# Altium schematic sheet Driver.SchDoc
size A4; SheetNumber: 1; SheetTotal: 1
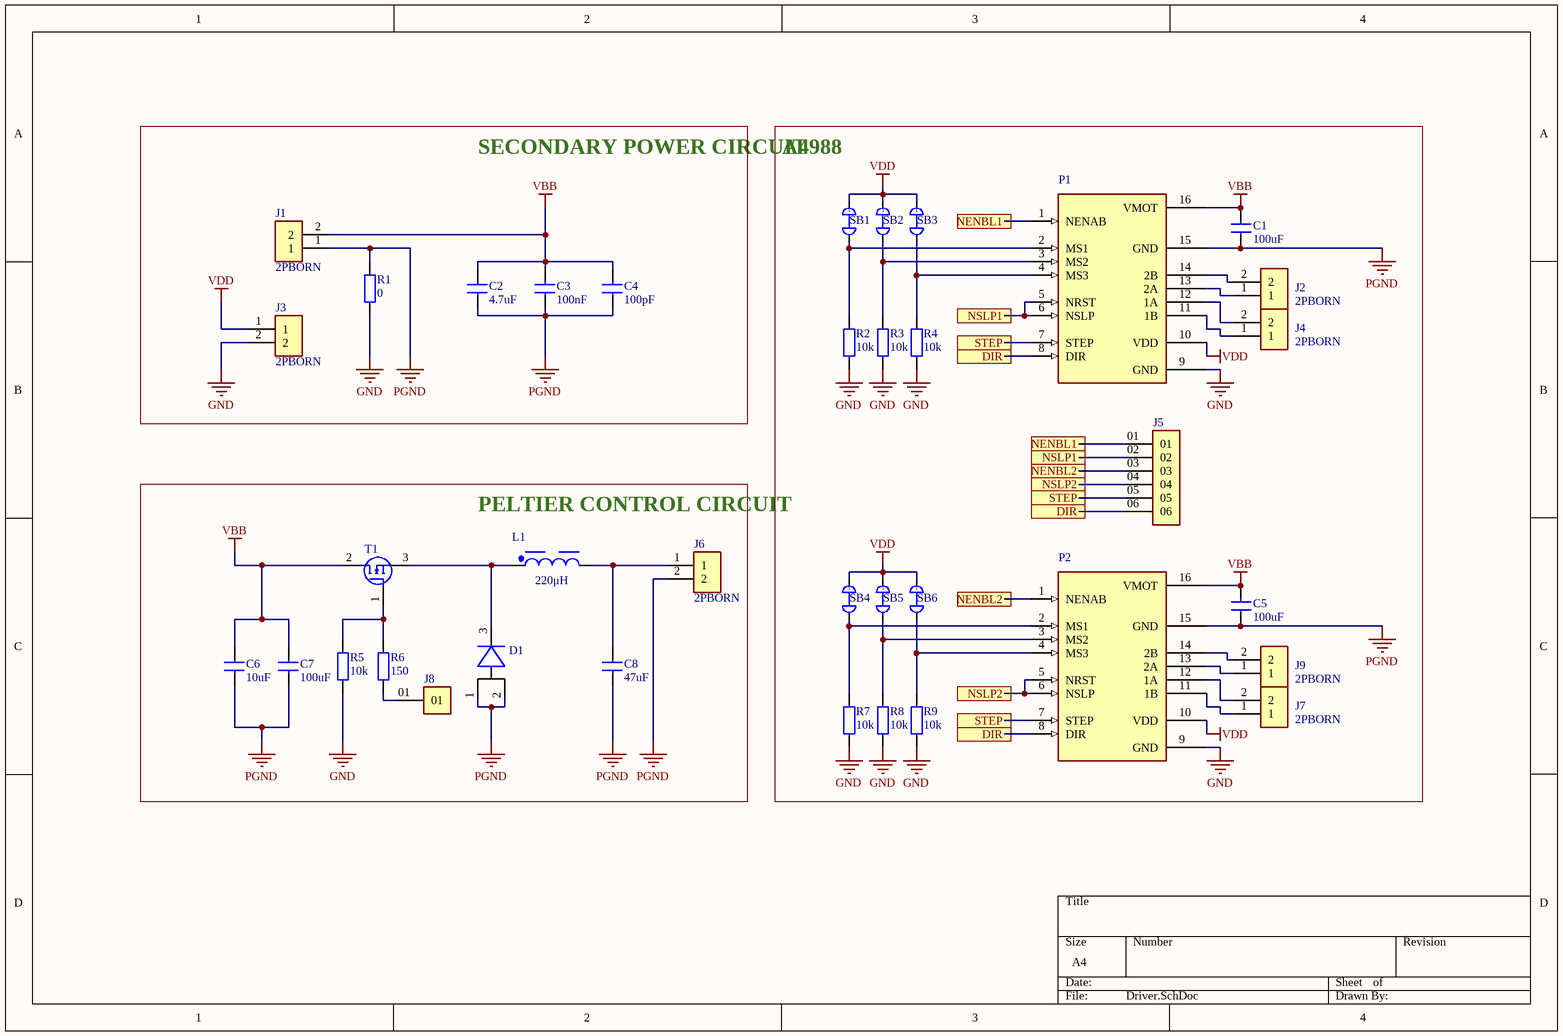
[diagram p0: Driver.SchDoc]

## Parts
C1  100uF  [RES_0805]
C2  4.7uF  [RES_0805]
C3  100nF  [RES_0805]
C4  100pF  [RES_0805]
C5  100uF  [RES_0805]
C6  10uF  [RES_0805]
C7  100uF  [RES_0805]
C8  47uF  [RES_0805]
D1  DIODE_FSV15150V  [FSV15150V_TO-277]  (value not drawn)
J1  2PBORN  [CUI_TB002-500-02BE]
J2  2PBORN  [CUI_TB002-500-02BE]
J3  2PBORN  [CUI_TB002-500-02BE]
J4  2PBORN  [CUI_TB002-500-02BE]
J5  PIN_HEADER_6  [GEN_PIN6]  (value not drawn)
J6  2PBORN  [CUI_TB002-500-02BE]
J7  2PBORN  [CUI_TB002-500-02BE]
J8  PIN_HEADER_1  [GEN_PIN1]  (value not drawn)
J9  2PBORN  [CUI_TB002-500-02BE]
L1  220μH  [WE-HCF_2920]
P1  2x8_PINES  [PINES8x2-sep]  (value not drawn)
P2  2x8_PINES  [PINES8x2-sep]  (value not drawn)
R1  0  [RES_0805]
R2  10k  [RES_0805]
R3  10k  [RES_0805]
R4  10k  [RES_0805]
R5  10k  [RES_0805]
R6  150  [RES_0805]
R7  10k  [RES_0805]
R8  10k  [RES_0805]
R9  10k  [RES_0805]
SB1  SolderBridge_Short  [SolderBridge_Short]  (value not drawn)
SB2  SolderBridge_Short  [SolderBridge_Short]  (value not drawn)
SB3  SolderBridge_Short  [SolderBridge_Short]  (value not drawn)
SB4  SolderBridge_Short  [SolderBridge_Short]  (value not drawn)
SB5  SolderBridge_Short  [SolderBridge_Short]  (value not drawn)
SB6  SolderBridge_Short  [SolderBridge_Short]  (value not drawn)
T1  NMOS-DMT10H010LK3  [MOSFET_TRANS_2DB1184Q-13]  (value not drawn)

## Blocks framed on the sheet
SECONDARY POWER CIRCUIT: C2-C4 J1 J3 R1
A4988: C1 C5 J2 J4 J5 J7 J9 P1 P2 R2-R4 R7-R9 SB1-SB6
PELTIER CONTROL CIRCUIT: C6-C8 D1 J6 J8 L1 R5 R6 T1

## Nets
GND: J3.2 P1.9(GND) P2.9(GND) R1.1 R2.1 R3.1 R4.1 R5.1 R7.1 R8.1 R9.1
PGND: C1.2 C2.1 C3.1 C4.1 C5.2 C6.1 C7.1 C8.1 D1.1(A) D1.2 J1.1 J6.2 P1.15(GND) P2.15(GND) R1.2
VBB: C1.1 C2.2 C3.2 C4.2 C5.1 C6.2 C7.2 J1.2 P1.16(VMOT) P2.16(VMOT) T1.2(D)
VDD: J3.1 P1.10(VDD) P2.10(VDD) SB1.1 SB2.1 SB3.1 SB4.1 SB5.1 SB6.1
DIR: J5.06 P1.8(DIR) P2.8(DIR)
NENBL1: J5.01 P1.1(NENAB)
NENBL2: J5.03 P2.1(NENAB)
NSLP1: J5.02 P1.5(NRST) P1.6(NSLP)
NSLP2: J5.04 P2.5(NRST) P2.6(NSLP)
STEP: J5.05 P1.7(STEP) P2.7(STEP)
NetC8_2: C8.2 J6.1 L1.2
NetD1_3: D1.3(C) L1.1 T1.3(S)
NetJ2_1: J2.1 P1.13(2A)
NetJ2_2: J2.2 P1.14(2B)
NetJ4_1: J4.1 P1.11(1B)
NetJ4_2: J4.2 P1.12(1A)
NetJ7_1: J7.1 P2.11(1B)
NetJ7_2: J7.2 P2.12(1A)
NetJ8_01: J8.01 R6.1
NetJ9_1: J9.1 P2.13(2A)
NetJ9_2: J9.2 P2.14(2B)
NetP1_2: P1.2(MS1) R2.2 SB1.2
NetP1_3: P1.3(MS2) R3.2 SB2.2
NetP1_4: P1.4(MS3) R4.2 SB3.2
NetP2_2: P2.2(MS1) R7.2 SB4.2
NetP2_3: P2.3(MS2) R8.2 SB5.2
NetP2_4: P2.4(MS3) R9.2 SB6.2
NetR5_2: R5.2 R6.2 T1.1(G)

## Library data of the parts
C1-C8 = CAP_0805: Generic Capacitor
J1-J4 J6 J7 J9 = 2PBorn-TB002-500-02BE: 2~24 Poles, Screw Type, Horizontal, 5.0 Pitch, 22~12 (AWG), Terminal Block Connector; MF: Same Sky; SnapEDA_Link: https://www.snapeda.com/parts/TB002-500-02BE/Same+Sky/view-part/?ref=snap; Package: None; Value: *; MP: TB002-500-02BE; Check_prices: https://www.snapeda.com/parts/TB002-500-02BE/Same+Sky/view-part/?ref=eda
J5 = PIN_HEADER_6: Generic 40 mils drill size, 100 mils step; MF: Samtec Inc.; MP: TS-106-T-A; SnapEDA_Link: https://www.snapeda.com/parts/TS-106-T-A/Samtec+Inc./view-part/?ref=snap; Package: None; Value: *; Check_prices: https://www.snapeda.com/parts/TS-106-T-A/Samtec+Inc./view-part/?ref=eda
J8 = PIN_HEADER_1: Generic 40 mils drill size, 100 mils step; MF: Samtec; MP: TS-101-T-AA; SnapEDA_Link: https://www.snapeda.com/parts/TS-101-T-AA/Samtec/view-part/?ref=snap; Package: None; Value: *; Check_prices: https://www.snapeda.com/parts/TS-101-T-AA/Samtec/view-part/?ref=eda
L1 = L220uH_74437529203221: WE-HCF SMT High Current Inductor, size 2920, 220μH, 8.15A, 40.1mΩ; Manufacturer: Wurth Elektronik; Case/Size Code: 2920; Saturation Current @ 10%: 4.1A; Saturation Current @ 30%: 5.3A; Self Resonant Frequency: 2.8MHz; Manufacturer Part Number: 74437529203221; Category: Power Inductors; Match Code: WE-HCF; ComponentLink1Description: Website Link; ComponentLink1URL: https://www.we-online.com/redexpert/article/74437529203221?ad; ComponentLink2Description: Datasheet Link; ComponentLink2URL: https://www.we-online.com/redexpert/spec/74437529203221?ad; Mount: Surface Mount; Min Operating Temperature: -40°C; Max Operating Temperature: 125°C; Packaging: Tray; Length: 28mm; Width: 25mm; Height: 20.5mm; DC Resistance Max: 40.1mΩ; Inductance: 220μH; Performance Rated Current: 8.15A
R1-R9 = RES_0805: Generic Capacitor